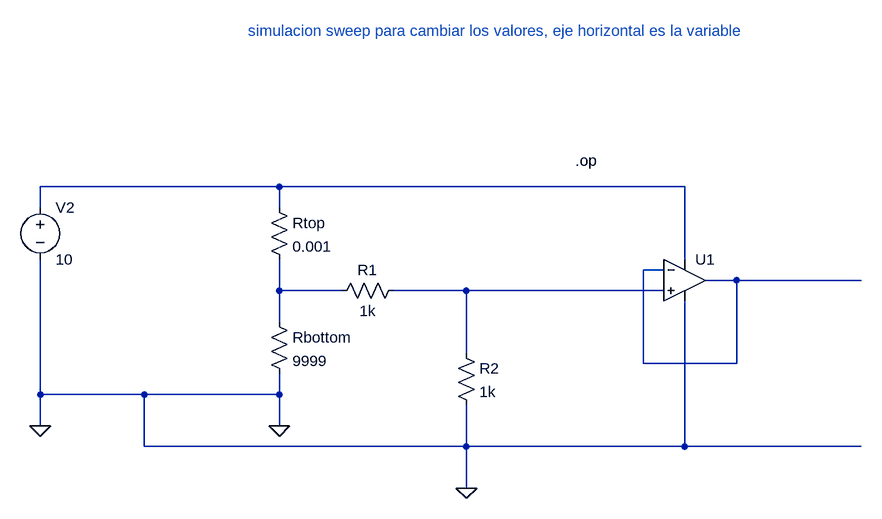
[diagram p0: schematic Simulación LTspice.asc]
Simulación LTspice.asc, the LTspice schematic file:
Version 4.1
SHEET 1 1000 680
WIRE -112 128 -480 128
WIRE 512 128 -112 128
WIRE -480 160 -480 128
WIRE -112 160 -112 128
WIRE 512 240 512 128
WIRE 480 256 448 256
WIRE 592 272 544 272
WIRE 784 272 592 272
WIRE -112 288 -112 240
WIRE -16 288 -112 288
WIRE 176 288 64 288
WIRE 480 288 176 288
WIRE -112 336 -112 288
WIRE 176 384 176 288
WIRE 448 400 448 256
WIRE 592 400 592 272
WIRE 592 400 448 400
WIRE -480 448 -480 240
WIRE -320 448 -480 448
WIRE -112 448 -112 416
WIRE -112 448 -320 448
WIRE -480 496 -480 448
WIRE -112 496 -112 448
WIRE -320 528 -320 448
WIRE 176 528 176 464
WIRE 176 528 -320 528
WIRE 512 528 512 304
WIRE 512 528 176 528
WIRE 784 528 512 528
WIRE 176 592 176 528
FLAG 176 592 0
FLAG -112 496 0
FLAG -480 496 0
DATAFLAG 768 528 ""
DATAFLAG 768 272 ""
SYMBOL res -32 304 R270
WINDOW 0 32 56 VTop 2
WINDOW 3 0 56 VBottom 2
SYMATTR InstName R1
SYMATTR Value 1k
SYMBOL res 160 368 R0
SYMATTR InstName R2
SYMATTR Value 1k
SYMBOL OpAmps\\UniversalOpAmp2 512 272 R0
SYMATTR InstName U1
SYMBOL voltage -480 144 R0
WINDOW 123 0 0 Left 0
WINDOW 39 0 0 Left 0
SYMATTR InstName V2
SYMATTR Value 10
SYMBOL res -128 144 R0
SYMATTR InstName Rtop
SYMATTR Value 0.001
SYMBOL res -128 320 R0
SYMATTR InstName Rbottom
SYMATTR Value 9999
TEXT 344 88 Left 2 !.op
TEXT -160 -112 Left 2 ;simulacion sweep para cambiar los valores, eje horizontal es la variable

The netlist it stands for:
* Simulación LTspice.asc
R1 N003 N004 1k
R2 N004 0 1k
X§U1 N004 N002 N001 0 N002 level2 Avol=1Meg GBW=10Meg Slew=10Meg Ilimit=25m Rail=0 Vos=0 En=0 Enk=0 In=0 Ink=0 Rin=500Meg  ; pins In+ In- V+ V- OUT
V2 N001 0 10
Rtop N001 N003 0.001
Rbottom N003 0 9999
.op
* simulacion sweep para cambiar los valores, eje horizontal es la variable
.lib UniversalOpAmp2.lib
.backanno
.end